# Altium schematic sheet MCU.SchDoc
size A2; SheetNumber: 2; SheetTotal: 2
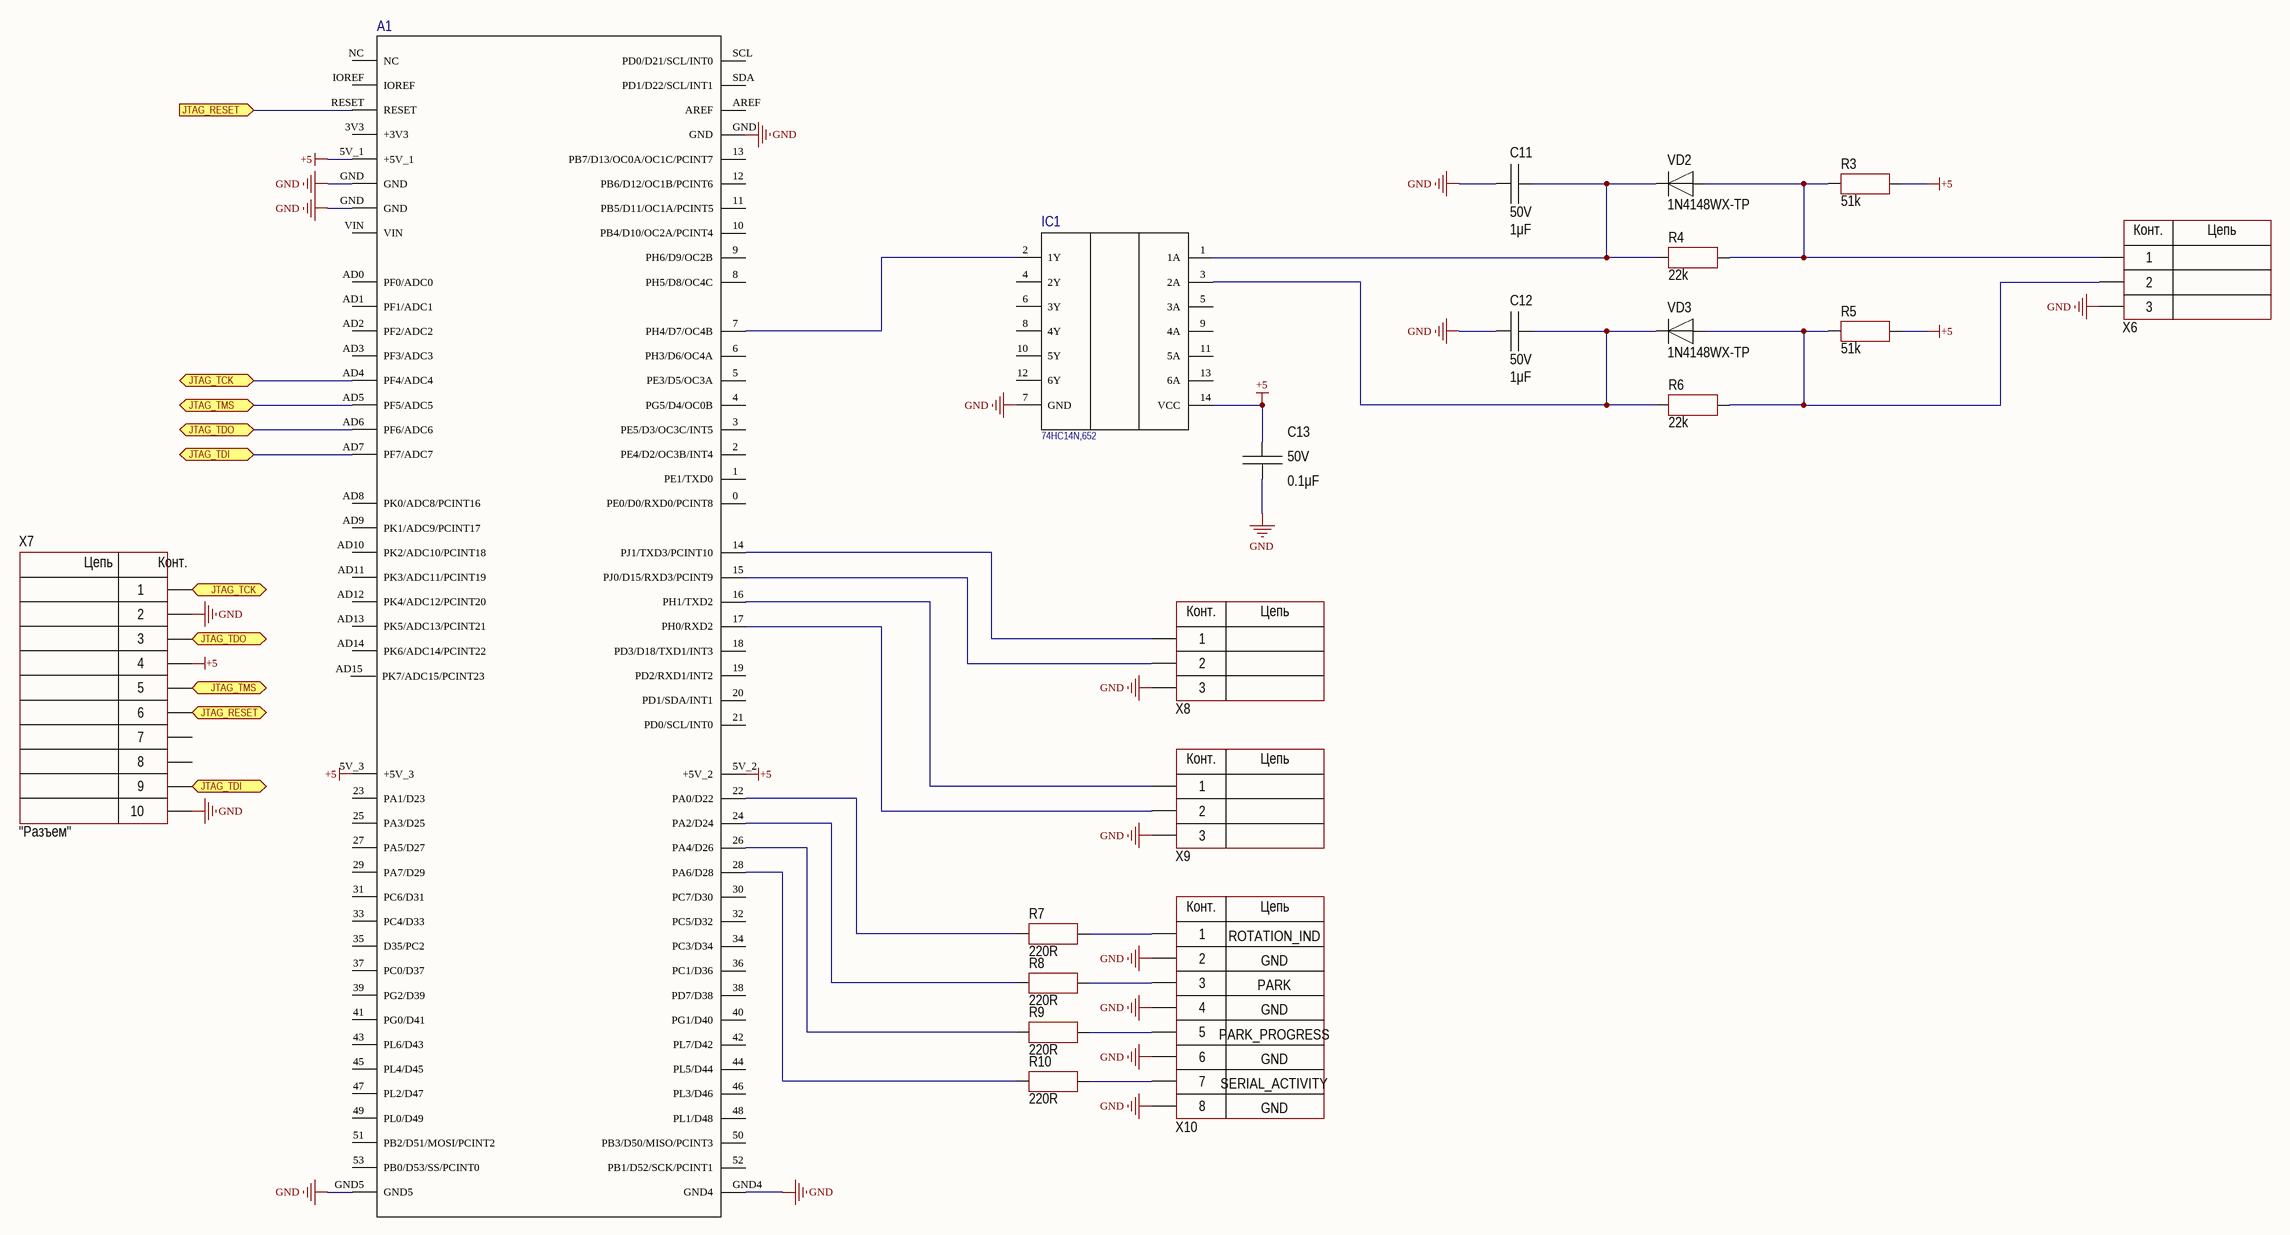
[diagram p0: MCU.SchDoc]

## Parts
A1  ARDUINO_MEGA_2560_REV3_A000067_1  [ARDUINO_ARDUINO_MEGA_2560_REV3_A000067]  (value not drawn)
C11  value 1μF  Voltage: 50V  [RAD-0.2]
C12  value 1μF  Voltage: 50V  [RAD-0.2]
C13  value 0.1μF  Voltage: 50V  [RAD-0.2]
IC1  74HC14N,652  [DIP254P762X420-14]
R3  value 51k  [AXIAL-0.3]
R4  value 22k  [AXIAL-0.3]
R5  value 51k  [AXIAL-0.3]
R6  value 22k  [AXIAL-0.3]
R7  value 220R  [AXIAL-0.3]
R8  value 220R  [AXIAL-0.3]
R9  value 220R  [AXIAL-0.3]
R10  value 220R  [AXIAL-0.3]
VD2  PartNumber: 1N4148WX-TP  [DIOAD1165W56L425D185]
VD3  PartNumber: 1N4148WX-TP  [DIOAD1165W56L425D185]
X6  (no value)  [2EDGR-5.08-03P]
X7  CommentText: "Разъем"  [CON: PLD-10]
X8  (no value)  [2EDGR-5.08-03P]
X9  (no value)  [2EDGR-5.08-03P]
X10  (no value)  [2EDGR-5.08-08P]

## Ports
JTAG_RESET (bidir), JTAG_RESET (in), JTAG_TCK (bidir), JTAG_TDI (bidir), JTAG_TDO (bidir), JTAG_TMS (bidir)

## Nets
+5: A1.5V_1(+5V_1) A1.5V_2(+5V_2) A1.5V_3(+5V_3) C13.2 IC1.14(VCC) R3.2 R5.2 X7.4
GND: A1.GND A1.GND4 A1.GND5 C11.2 C12.2 C13.1 IC1.7(GND) X6.3 X7.2 X7.10 X8.3 X9.3 X10.2 X10.4 X10.6 X10.8
JTAG_RESET: A1.RESET X7.6 ; port JTAG_RESET
JTAG_TCK: A1.AD4(PF4/ADC4) X7.1 ; port JTAG_TCK
JTAG_TDI: A1.AD7(PF7/ADC7) X7.9 ; port JTAG_TDI
JTAG_TDO: A1.AD6(PF6/ADC6) X7.3 ; port JTAG_TDO
JTAG_TMS: A1.AD5(PF5/ADC5) X7.5 ; port JTAG_TMS
NetA1_7: A1.7(PH4/D7/OC4B) IC1.2(1Y)
NetA1_14: A1.14(PJ1/TXD3/PCINT10) X8.1
NetA1_15: A1.15(PJ0/D15/RXD3/PCINT9) X8.2
NetA1_16: A1.16(PH1/TXD2) X9.1
NetA1_17: A1.17(PH0/RXD2) X9.2
NetA1_22: A1.22(PA0/D22) R7.1
NetA1_24: A1.24(PA2/D24) R8.1
NetA1_26: A1.26(PA4/D26) R9.1
NetA1_28: A1.28(PA6/D28) R10.1
NetC11_1: C11.1 IC1.1(1A) R4.1 VD2.2
NetC12_1: C12.1 IC1.3(2A) R6.1 VD3.2
NetR3_1: R3.1 R4.2 VD2.1 X6.1
NetR5_1: R5.1 R6.2 VD3.1 X6.2
NetR7_2: R7.2 X10.1
NetR8_2: R8.2 X10.3
NetR9_2: R9.2 X10.5
NetR10_2: R10.2 X10.7

Not connected (* = marked no-connect by the designer): A1 0(PE0/D0/RXD0/PCINT8) 1(PE1/TXD0) 2(PE4/D2/OC3B/INT4) 3(PE5/D3/OC3C/INT5) 3V3(+3V3) 4(PG5/D4/OC0B) 5(PE3/D5/OC3A) 6(PH3/D6/OC4A) 8(PH5/D8/OC4C) 9(PH6/D9/OC2B) 10(PB4/D10/OC2A/PCINT4) 11(PB5/D11/OC1A/PCINT5) 12(PB6/D12/OC1B/PCINT6) 13(PB7/D13/OC0A/OC1C/PCINT7) 18(PD3/D18/TXD1/INT3) 19(PD2/RXD1/INT2) 20(PD1/SDA/INT1) 21(PD0/SCL/INT0) 23(PA1/D23) 25(PA3/D25) 27(PA5/D27) 29(PA7/D29) 30(PC7/D30) 31(PC6/D31) 32(PC5/D32) 33(PC4/D33) 34(PC3/D34) 35(D35/PC2) 36(PC1/D36) 37(PC0/D37) 38(PD7/D38) 39(PG2/D39) 40(PG1/D40) 41(PG0/D41) 42(PL7/D42) 43(PL6/D43) 44(PL5/D44) 45(PL4/D45) 46(PL3/D46) 47(PL2/D47) 48(PL1/D48) 49(PL0/D49) 50(PB3/D50/MISO/PCINT3) 51(PB2/D51/MOSI/PCINT2) 52(PB1/D52/SCK/PCINT1) 53(PB0/D53/SS/PCINT0) AD0(PF0/ADC0) AD1(PF1/ADC1) AD2(PF2/ADC2) AD3(PF3/ADC3) AD8(PK0/ADC8/PCINT16) AD9(PK1/ADC9/PCINT17) AD10(PK2/ADC10/PCINT18) AD11(PK3/ADC11/PCINT19) AD12(PK4/ADC12/PCINT20) AD13(PK5/ADC13/PCINT21) AD14(PK6/ADC14/PCINT22) AD15(PK7/ADC15/PCINT23) AREF IOREF NC SCL(PD0/D21/SCL/INT0) SDA(PD1/D22/SCL/INT1) VIN; IC1 4(2Y) 5(3A) 6(3Y) 8(4Y) 9(4A) 10(5Y) 11(5A) 12(6Y) 13(6A); X7 7 8

## Notes on the sheet
- ROTATION_IND
- GND
- PARK
- (near X10) PARK_PROGRESS
- (near X10) SERIAL_ACTIVITY
- (in symbol 2EDGR-5.08-03P) Конт.; Цепь
- (in symbol 2EDGR-5.08-08P) Конт.; Цепь
- (in symbol PLD-10) Цепь; Конт.

## Library data of the parts
A1 = ARDUINO_MEGA_2560_REV3_A000067_1: ATmega2560 Arduino Mega2560 AVR® ATmega AVR MCU 8-Bit Embedded Evaluation Board; MP: ARDUINO MEGA 2560 REV3 | A000067; SnapEDA_Link: https://www.snapeda.com/parts/ARDUINO%20MEGA%202560%20REV3%20%7C%20A000067/Arduino/view-part/?ref=snap; Package: Non-Standard Arduino; Value: *; MF: Arduino; Check_prices: https://www.snapeda.com/parts/ARDUINO%20MEGA%202560%20REV3%20%7C%20A000067/Arduino/view-part/?ref=eda
C11 C12 = Ceramic_1206: Manufacturer: Yageo; PartNumber: CC1206KRX7R9BB104; ValueManufacturerPartNumber: Ceramic capacitor, 1μF, X7R, ±10%, 50V, 1206, -55...+125°C; TypeCapacitor: Ceramic capacitor; Tolerance: ±10%; TypeDielectric: X7R; Package: 1206; HelpURL: https://www.digikey.com/product-detail/en/yageo/CC1206KRX7R9BB104/311-1179-1-ND/303089; Temperature: -55...+125°C
C13 = Ceramic_1206: Manufacturer: Yageo; PartNumber: CC1206KRX7R9BB104; ValueManufacturerPartNumber: Ceramic capacitor, 0.1μF, X7R, ±10%, 50V, 1206, -55...+125°C; TypeCapacitor: Ceramic capacitor; Tolerance: ±10%; TypeDielectric: X7R; Package: 1206; HelpURL: https://www.digikey.com/product-detail/en/yageo/CC1206KRX7R9BB104/311-1179-1-ND/303089; Temperature: -55...+125°C
IC1 = 74HC14N,652: Integrated Circuit; Manufacturer_Name: Nexperia; Manufacturer_Part_Number: 74HC14N,652; Arrow Part Number: 74HC14N,652; Arrow Price/Stock: https://www.arrow.com/en/products/74hc14n652/nexperia
R3-R10 = Resistor_1206: Manufacturer: Yageo; PartNumber: RC1206JR-07100RL; TypeResistor: Resistor film; Power: 0.25W; Package: 1206; HelpURL: https://www.digikey.com/product-detail/en/yageo/RC1206JR-07100RL/311-100ERCT-ND/732153; ValueManufacturerPartNumber: =TypeResistor+', '+Value+', '+Tolerance+', '+Package+', '+Power+', '+Temperature; Temperature: -55...+125°C
VD2 VD3 = Diode_single: Manufacturer: Micro Commercial; ValueManufacturerPartNumber: Single diode, 75V, 150mA, 1V, 4ns, SOD-323, -55...+150°C; TypeDiode: Single diode; Voltage: 75V; Current: 150mA; VoltageDrop: 1V; RecoveryTime: 4ns; Package: SOD-323; HelpURL: https://www.digikey.com/product-detail/en/micro-commercial-co/1N4148WX-TP/1N4148WXTPMSCT-ND/717312; Temperature: -55...+150°C
X6 X8 X9 = 2EDGR-5.08-03P: Manufacturer: Connfly; ValueManufacturerPartNumber: Connector, 6pin, 2.54mm, 500VAC, 3A; PartNumber: PBS-6; TypeConnector: Connector; VoltageMax: 500VAC; Pitch: 2.54mm; CurrentMax: 3A; Multichannel: 6pin; CommentText: "Разъем"; HelpURL: https://www.chipdip.ru/product/pbs-6
X7 = PLD-10: Manufacturer: Connfly; ValueManufacturerPartNumber: Connector, 10pin, 2.54mm, 500VAC, 3A; TypeConnector: Connector; VoltageMax: 500VAC; Pitch: 2.54mm; CurrentMax: 3A; Multichannel: 10pin; HelpURL: https://www.chipdip.ru/product/pld-10; PartNumber: PLD-10
X10 = 2EDGR-5.08-08P: Manufacturer: Connfly; ValueManufacturerPartNumber: Connector, 6pin, 2.54mm, 500VAC, 3A; PartNumber: PBS-6; TypeConnector: Connector; VoltageMax: 500VAC; Pitch: 2.54mm; CurrentMax: 3A; Multichannel: 6pin; CommentText: "Разъем"; HelpURL: https://www.chipdip.ru/product/pbs-6